# EAGLE schematic Components (EAGLE 9.6.2)
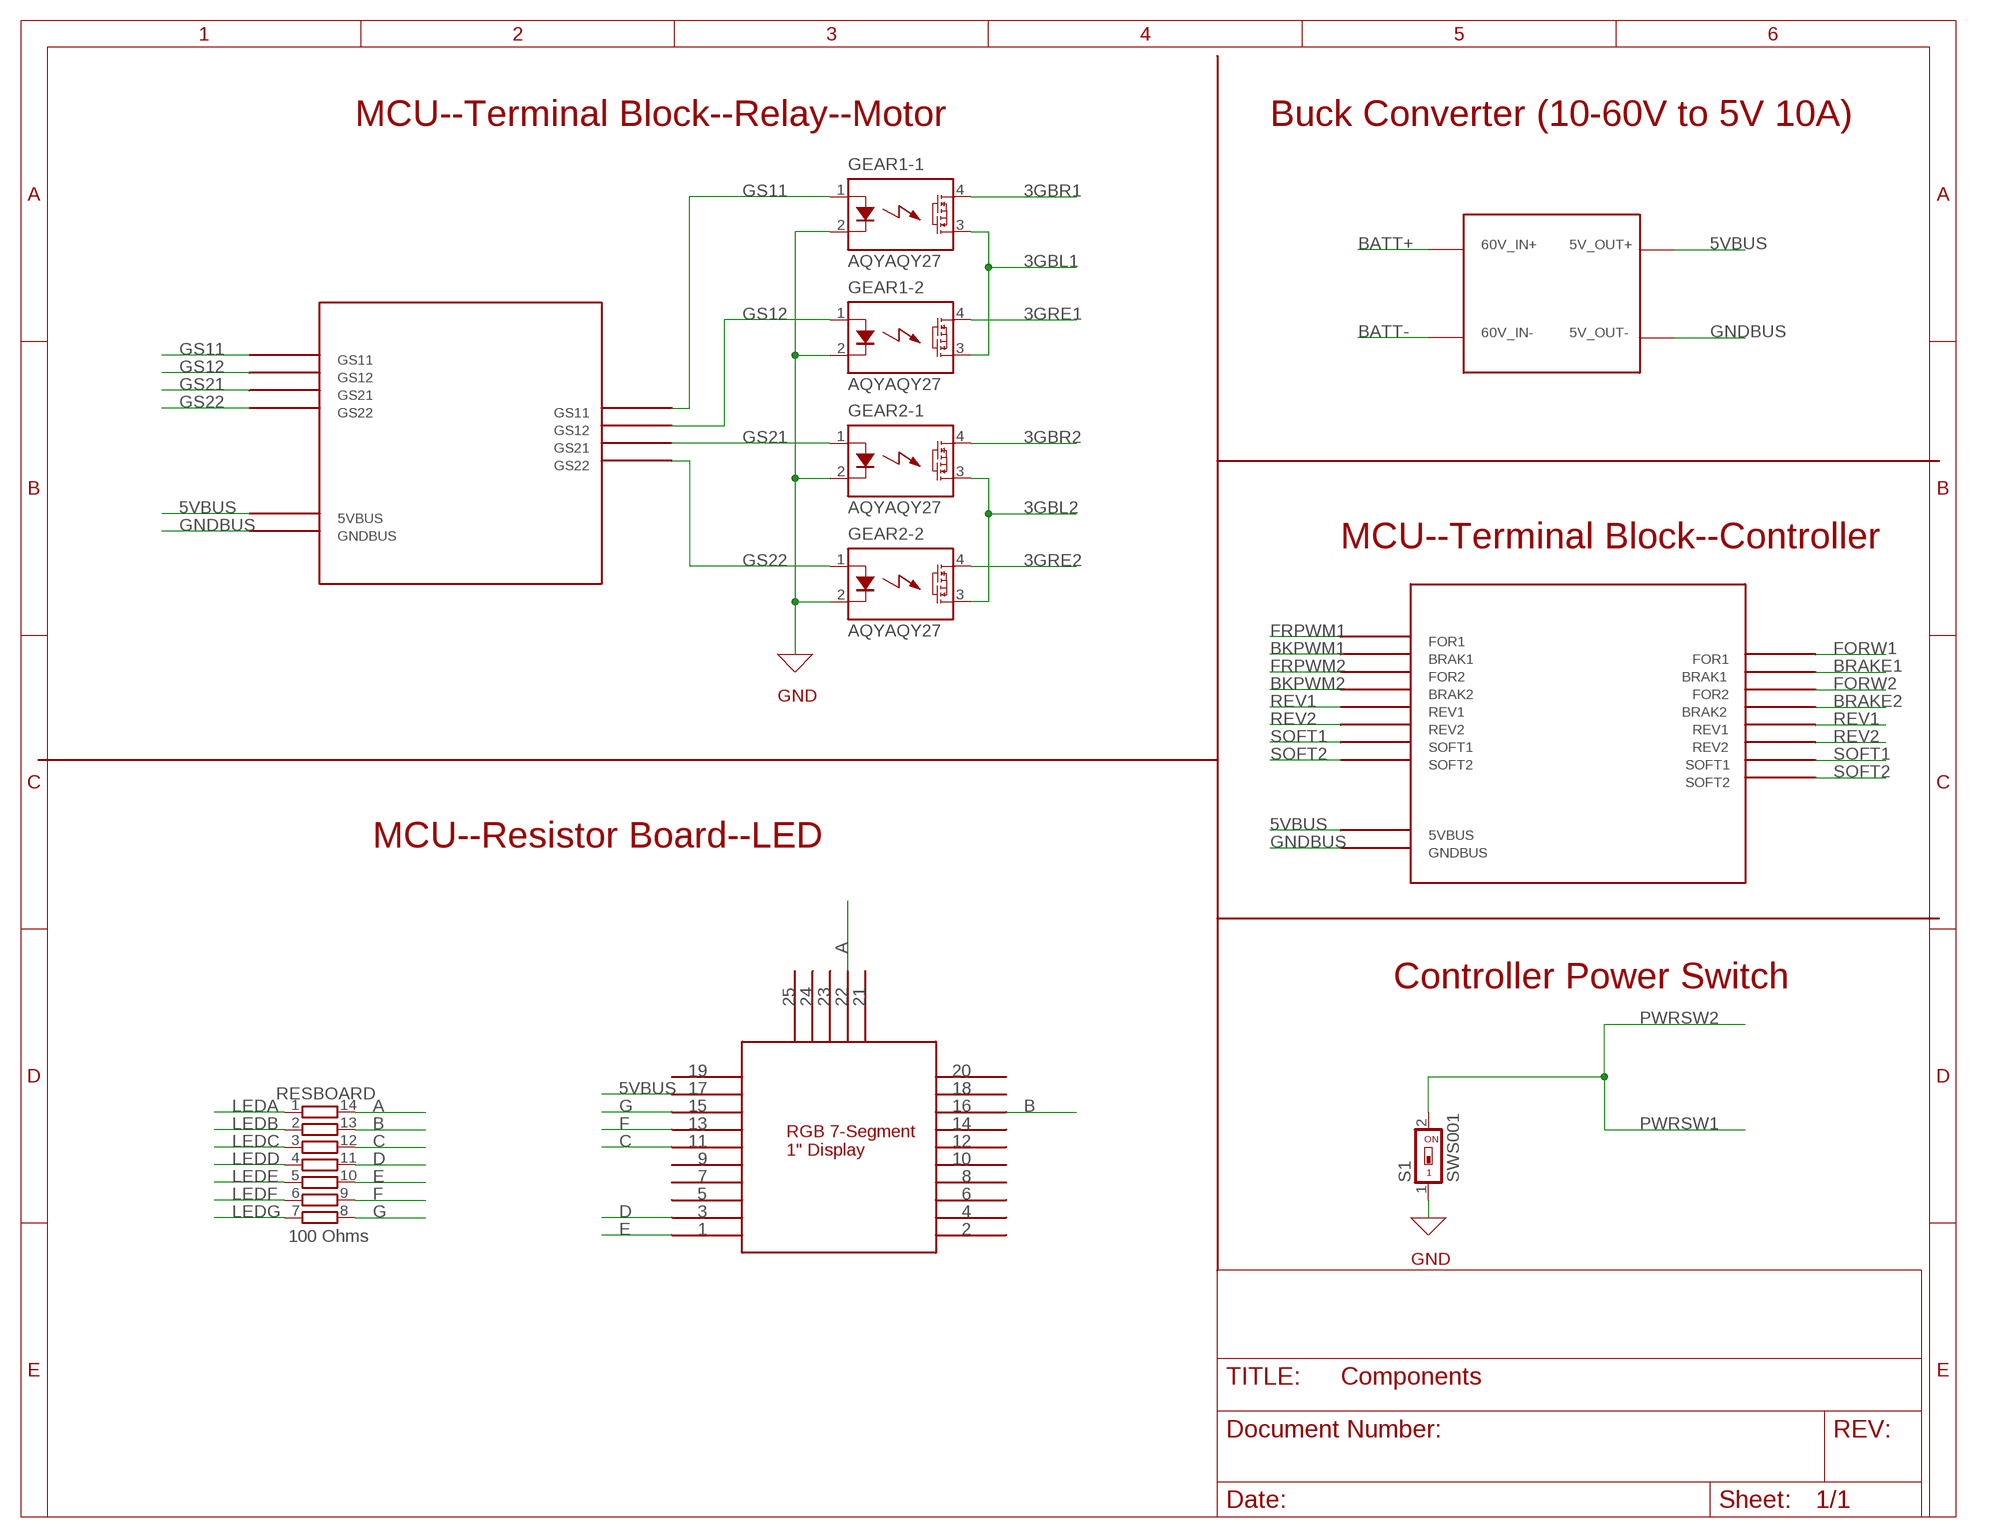
[diagram p0: schematic, sheet 1]

## Parts
GEAR1-1  AQYAQY27  [AQY27]
GEAR1-2  AQYAQY27  [AQY27]
GEAR2-1  AQYAQY27  [AQY27]
GEAR2-2  AQYAQY27  [AQY27]
RESBOARD  100 Ohms  4814P-T01  [4814P]
S1  SWS001  [SMS-001]

## Nets
0: GEAR1-1.2(K) GEAR1-2.2(K) GEAR2-1.2(K) GEAR2-2.2(K) S1.1 ; supply symbol labelled GND
3GBL1: GEAR1-1.3(DS2) GEAR1-2.3(DS2)
3GBL2: GEAR2-1.3(DS2) GEAR2-2.3(DS2)
3GBR1: GEAR1-1.4(DS1)
3GBR2: GEAR2-1.4(DS1)
3GRE1: GEAR1-2.4(DS1)
3GRE2: GEAR2-2.4(DS1)
A: RESBOARD.14
B: RESBOARD.13
C: RESBOARD.12
D: RESBOARD.11
E: RESBOARD.10
F: RESBOARD.9
G: RESBOARD.8
GS11: GEAR1-1.1(A)
GS12: GEAR1-2.1(A)
GS21: GEAR2-1.1(A)
GS22: GEAR2-2.1(A)
LEDA: RESBOARD.1
LEDB: RESBOARD.2
LEDC: RESBOARD.3
LEDD: RESBOARD.4
LEDE: RESBOARD.5
LEDF: RESBOARD.6
LEDG: RESBOARD.7
PWRSW2: S1.2

## Notes on the sheet
- MCU--Terminal Block--Relay--Motor | Buck Converter (10-60V to 5V 10A)
- 60V_IN+ | 5V_OUT+
- 60V_IN- | 5V_OUT-
- GS11
- GS12
- GS21
- GS22 | GS11
- GS12
- GS21
- GS22
- 5VBUS
- GNDBUS
- MCU--Terminal Block--Controller
- FOR1
- BRAK1 | FOR1
- FOR2 | BRAK1
- GND | BRAK2 | FOR2
- REV1 | BRAK2
- REV2 | REV1
- SOFT1 | REV2
- SOFT2 | SOFT1
- SOFT2
- 5VBUS
- MCU--Resistor Board--LED | GNDBUS
- Controller Power Switch
- 25 | 24 | 23 | 22 | 21
- 19 | 20
- 17 | 18
- 15 | 16
- 13 | 14 | PWRSW1
- 11 | 12
- RGB 7-Segment 
  1" Display
- 9 | 10
- 7 | 8
- 5 | 6
- 3 | 4
- 1 | 2
- GND

## Library data of the parts
GEAR1-1 GEAR1-2 GEAR2-1 GEAR2-2 = relay:AQY*: PhotoMOS Relay NAiS Source: http://www.panasonic-electric-works.com/catalogues/downloads/photomos/ds_x615_en_aqz10_20.pdf; OC_FARNELL: unknown; OC_NEWARK: unknown
RESBOARD = resistor-bourns:4814P-T01: BOURNS RESISTOR NETWORK; MF: BOURNS, INC.; MPN: 4814P-T01-104LF; OC_FARNELL: 9357386; OC_NEWARK: 33K0526
S1 = smd-special:SWS001: SMD Dip Switch 1 pol.